# EAGLE schematic ManualBot (EAGLE 8.5.2)
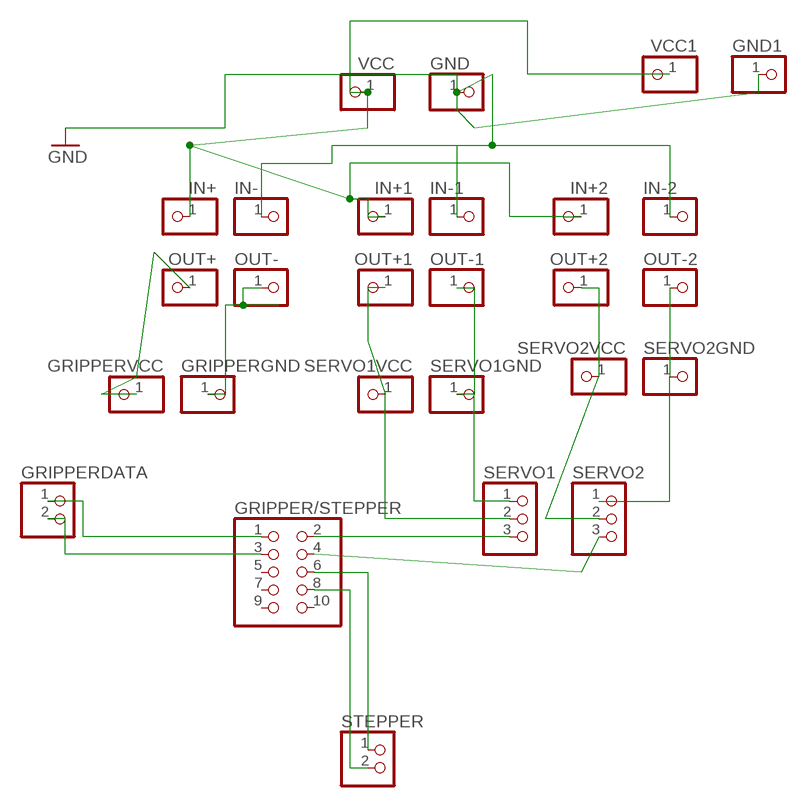
[diagram p0: schematic, sheet 1]

## Parts
GND  PINHD-1X1  [1X01]
GND1  PINHD-1X1  [1X01]
GRIPPER/STEPPER  PINHD-2X5  [2X05]
GRIPPERDATA  PINHD-1X2  [1X02]
GRIPPERGND  PINHD-1X1  [1X01]
GRIPPERVCC  PINHD-1X1  [1X01]
IN+  PINHD-1X1  [1X01]
IN+1  PINHD-1X1  [1X01]
IN+2  PINHD-1X1  [1X01]
IN-  PINHD-1X1  [1X01]
IN-1  PINHD-1X1  [1X01]
IN-2  PINHD-1X1  [1X01]
OUT+  PINHD-1X1  [1X01]
OUT+1  PINHD-1X1  [1X01]
OUT+2  PINHD-1X1  [1X01]
OUT-  PINHD-1X1  [1X01]
OUT-1  PINHD-1X1  [1X01]
OUT-2  PINHD-1X1  [1X01]
SERVO1  PINHD-1X3  [1X03]
SERVO1GND  PINHD-1X1  [1X01]
SERVO1VCC  PINHD-1X1  [1X01]
SERVO2  PINHD-1X3  [1X03]
SERVO2GND  PINHD-1X1  [1X01]
SERVO2VCC  PINHD-1X1  [1X01]
STEPPER  PINHD-1X2  [1X02]
VCC  PINHD-1X1  [1X01]
VCC1  PINHD-1X1  [1X01]

## Nets
GND: GND1.1 GND.1 IN-1.1 IN-2.1 IN-.1
N$1: GRIPPERVCC.1 OUT+.1
N$2: IN+1.1 IN+2.1 IN+.1 VCC1.1 VCC.1
N$4: GRIPPERGND.1 OUT-.1
N$6: GRIPPER/STEPPER.6 STEPPER.1
N$7: OUT+1.1 SERVO1.2 SERVO1VCC.1
N$8: OUT-1.1 SERVO1.1 SERVO1GND.1
N$9: OUT+2.1 SERVO2.2 SERVO2VCC.1
N$10: OUT-2.1 SERVO2.1 SERVO2GND.1
N$11: GRIPPER/STEPPER.8 STEPPER.2
N$12: GRIPPER/STEPPER.2 SERVO1.3
N$13: GRIPPER/STEPPER.4 SERVO2.3
N$14: GRIPPER/STEPPER.3 GRIPPERDATA.2
N$15: GRIPPER/STEPPER.1 GRIPPERDATA.1
Unconnected: GRIPPER/STEPPER.5 GRIPPER/STEPPER.7 GRIPPER/STEPPER.9 GRIPPER/STEPPER.10

## Library data of the parts
GND GND1 GRIPPERGND GRIPPERVCC IN+ IN+1 IN+2 IN- IN-1 IN-2 OUT+ OUT+1 OUT+2 OUT- OUT-1 OUT-2 SERVO1GND SERVO1VCC SERVO2GND SERVO2VCC VCC VCC1 = pinhead:PINHD-1X1: PIN HEADER
GRIPPER/STEPPER = pinhead:PINHD-2X5: PIN HEADER
GRIPPERDATA STEPPER = pinhead:PINHD-1X2: PIN HEADER
SERVO1 SERVO2 = pinhead:PINHD-1X3: PIN HEADER